# Altium schematic sheet EDU_High-Speed-Design_Connectors.SchDoc: Ethernet
size 431 x 279 mm; Date: not used; ApprovedBy: not used; CheckedBy: not used; Author: not used; DrawnBy: not used; Organization: not used; Address4: not used; SheetNumber: 6; SheetTotal: 26; Time: not used; ImagePath: not used; Application_BuildNumber: not used
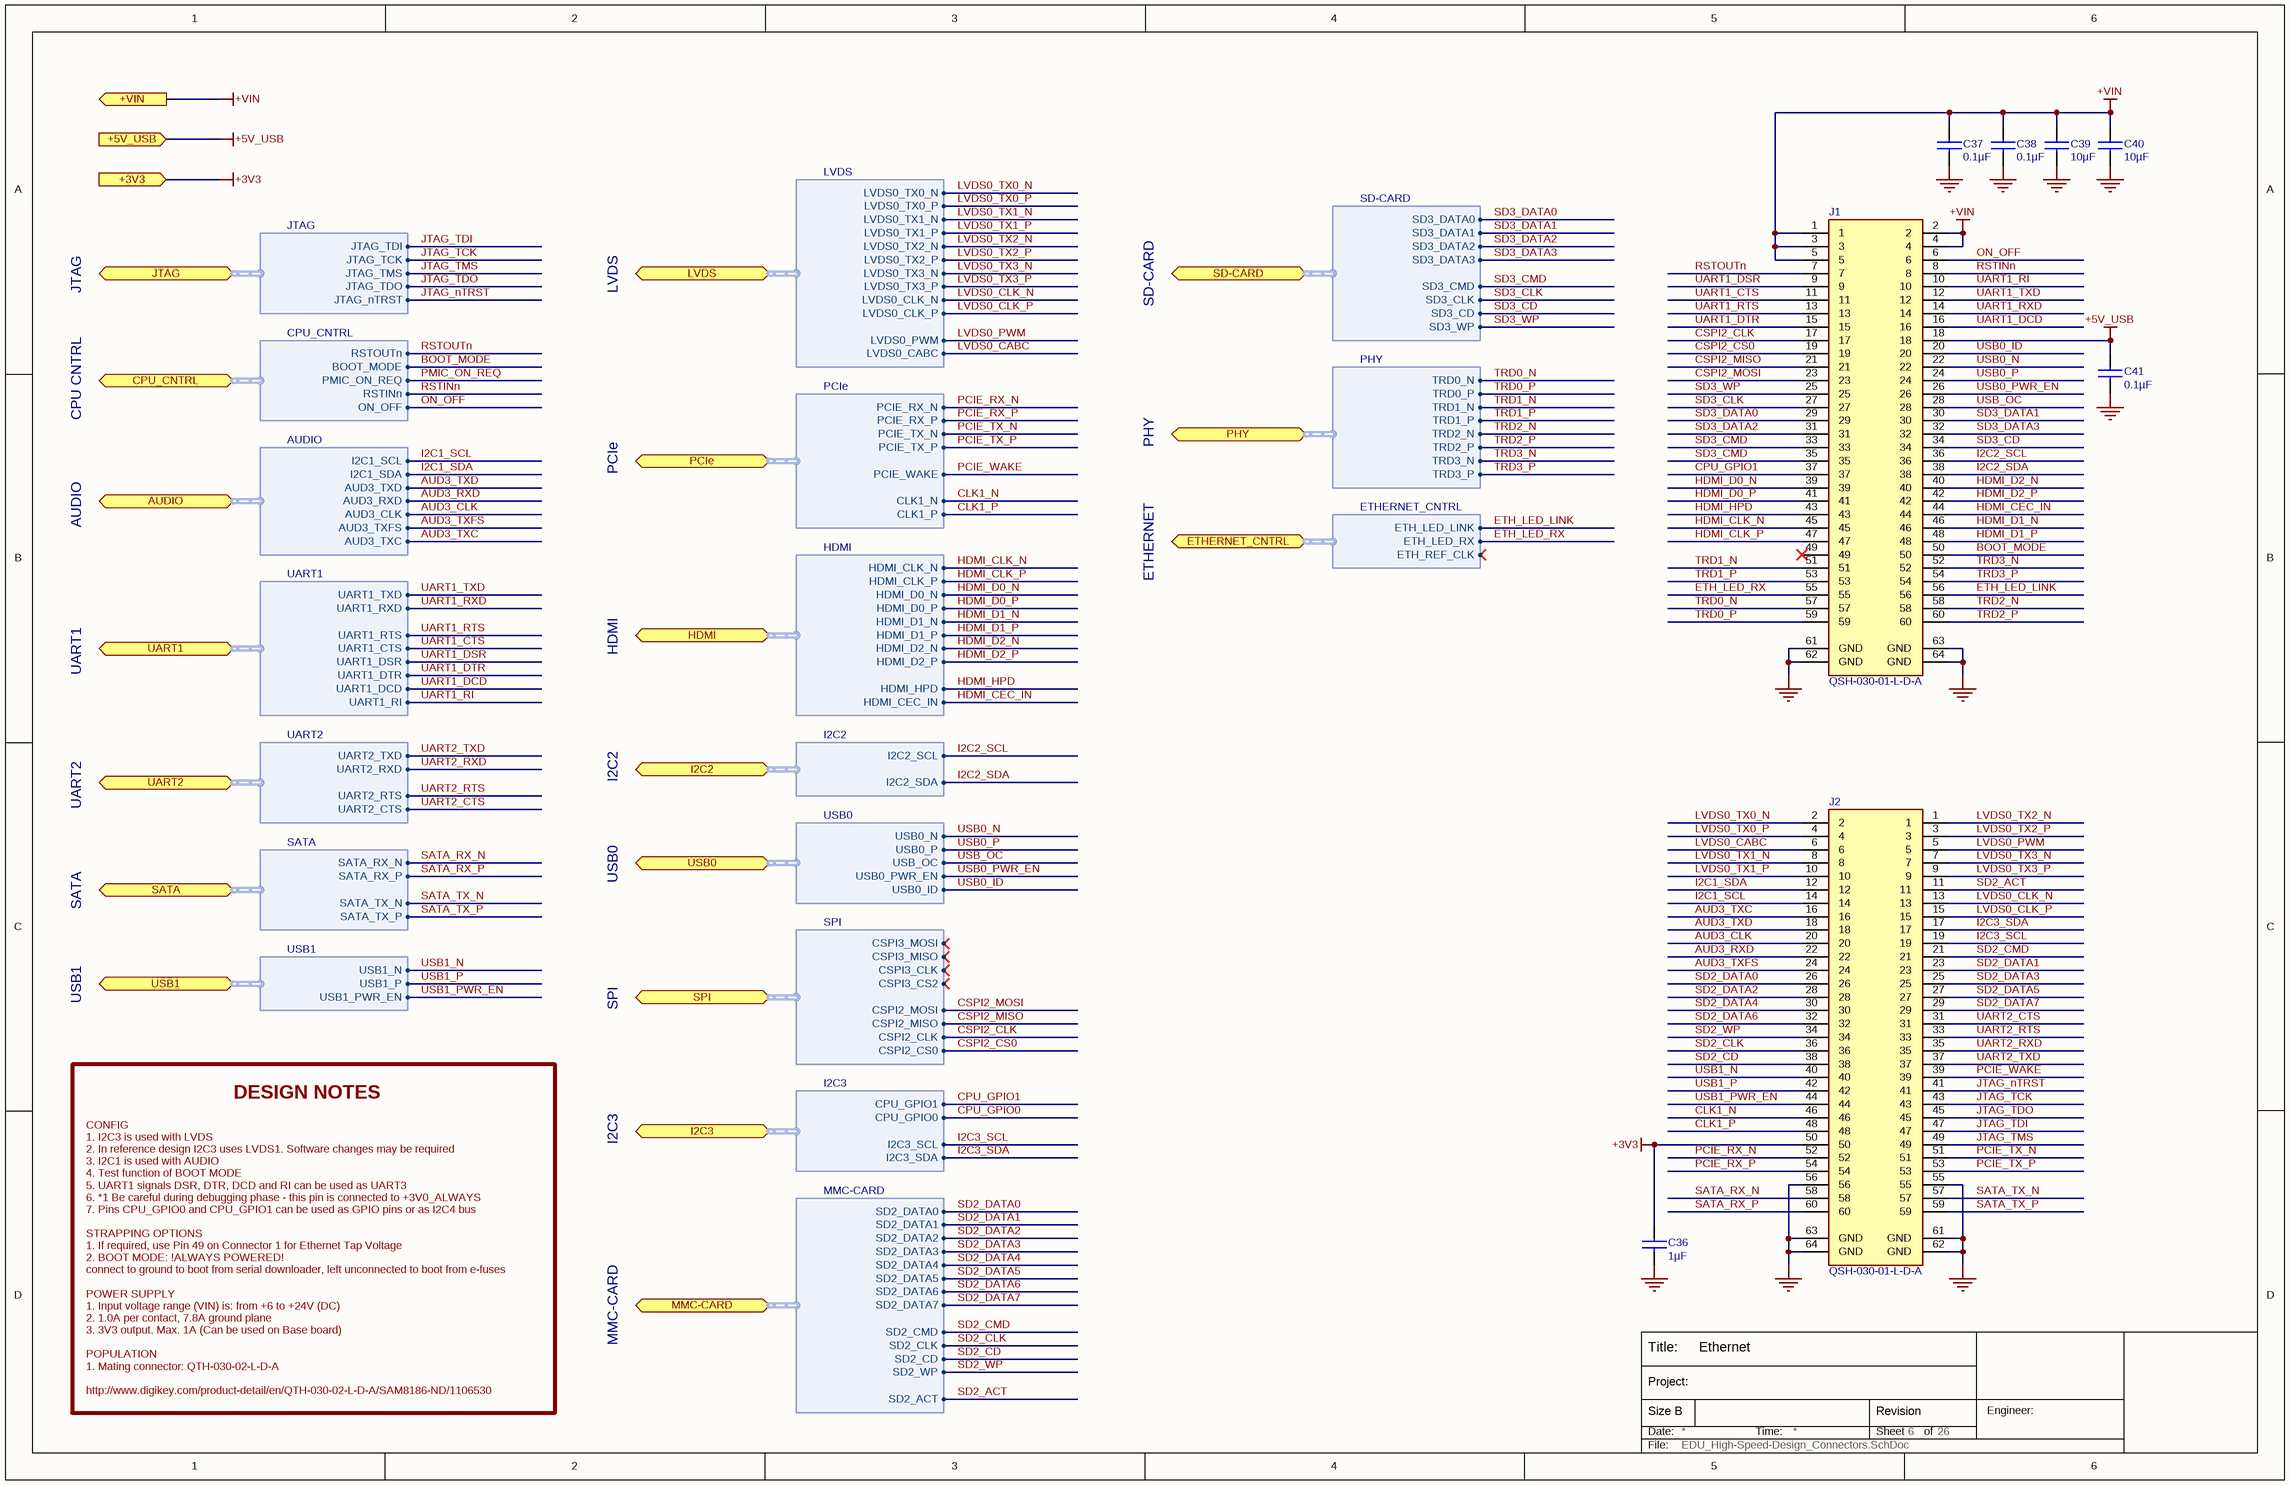
[diagram p0: EDU_High-Speed-Design_Connectors.SchDoc]

## Parts
C36  1µF  [C0402]
C37  0.1µF  [C0402]
C38  0.1µF  [C0402]
C39  10µF  [C1206]
C40  10µF  [C1206]
C41  0.1µF  [C0402]
J1  QSH-030-01-L-D-A  [QSH-030-01-L-D-A]
J2  QSH-030-01-L-D-A  [QSH-030-01-L-D-A]

## Ports
+3V3 (in), +5V_USB (in), +VIN (out), AUDIO (bidir, harness AUDIO), CPU_CNTRL (bidir, harness CPU_CNTRL), ETHERNET_CNTRL (bidir, harness ETHERNET_CNTRL), HDMI (bidir, harness HDMI), I2C2 (bidir, harness I2C2), I2C3 (bidir, harness I2C3), JTAG (bidir, harness JTAG), LVDS (bidir, harness LVDS), MMC-CARD (bidir, harness MMC-CARD), PCIe (bidir, harness PCIe), PHY (bidir, harness PHY), SATA (bidir, harness SATA), SD-CARD (bidir, harness SD-CARD), SPI (bidir, harness SPI), UART1 (bidir, harness UART1), UART2 (bidir, harness UART2), USB0 (bidir, harness USB0), USB1 (bidir, harness USB1)

## Harnesses
JTAG: JTAG_TDI, JTAG_TCK, JTAG_TMS, JTAG_nTRST, JTAG_TDO
CPU_CNTRL: RSTOUTn, PMIC_ON_REQ, ON_OFF, BOOT_MODE, RSTINn
AUDIO: I2C1_SCL, AUD3_TXD, AUD3_RXD, I2C1_SDA, AUD3_CLK, AUD3_TXFS, AUD3_TXC
UART1: UART1_TXD, UART1_RTS, UART1_CTS, UART1_RXD, UART1_DSR, UART1_DTR, UART1_DCD, UART1_RI
UART2: UART2_TXD, UART2_RTS, UART2_CTS, UART2_RXD
SATA: SATA_RX_N, SATA_TX_N, SATA_RX_P, SATA_TX_P
LVDS: LVDS0_TX0_N, LVDS0_TX1_P, LVDS0_TX2_N, LVDS0_TX1_N, LVDS0_TX2_P, LVDS0_TX0_P, LVDS0_TX3_N, LVDS0_TX3_P, LVDS0_CLK_N, LVDS0_CLK_P, LVDS0_PWM, LVDS0_CABC
PCIe: PCIE_RX_N, PCIE_TX_P, PCIE_TX_N, PCIE_WAKE, PCIE_RX_P, CLK1_N, CLK1_P
HDMI: HDMI_CLK_N, HDMI_D0_P, HDMI_D1_N, HDMI_D0_N, HDMI_D1_P, HDMI_CLK_P, HDMI_D2_N, HDMI_D2_P, HDMI_HPD, HDMI_CEC_IN
I2C2: I2C2_SCL, I2C2_SDA
USB0: USB0_N, USB_OC, USB0_PWR_EN, USB0_P, USB0_ID
USB1: USB1_N, USB1_PWR_EN, USB1_P
SPI: CSPI3_MOSI, CSPI3_MISO, CSPI3_CLK, CSPI3_CS2, CSPI2_MOSI, CSPI2_MISO, CSPI2_CLK, CSPI2_CS0
I2C3: CPU_GPIO0, I2C3_SCL, CPU_GPIO1, I2C3_SDA
MMC-CARD: SD2_DATA0, SD2_CLK, SD2_CD, SD2_WP, SD2_CMD, SD2_DATA1, SD2_DATA2, SD2_DATA3, SD2_DATA4, SD2_DATA5, SD2_DATA6, SD2_DATA7, SD2_ACT
SD-CARD: SD3_DATA0, SD3_DATA3, SD3_DATA2, SD3_CLK, SD3_DATA1, SD3_CD, SD3_WP, SD3_CMD
PHY: TRD0_N, TRD0_P, TRD1_N, TRD2_N, TRD2_P, TRD3_N, TRD1_P, TRD3_P
ETHERNET_CNTRL: ETH_LED_LINK, ETH_REF_CLK, ETH_LED_RX

## Nets
+3V3: C36.1 J2.50 ; port +3V3
+5V_USB: C41.1 J1.18 ; port +5V_USB
+VIN: C37.1 C38.1 C39.1 C40.1 J1.1 J1.2 J1.3 J1.4 J1.5 ; port +VIN
GND: C36.2 C37.2 C38.2 C39.2 C40.2 C41.2 J1.61(GND) J1.62(GND) J1.63(GND) J1.64(GND) J2.55 J2.56 J2.61(GND) J2.62(GND) J2.63(GND) J2.64(GND)
AUD3_CLK: J2.20 ; port AUDIO.AUD3_CLK
AUD3_RXD: J2.22 ; port AUDIO.AUD3_RXD
AUD3_TXC: J2.16 ; port AUDIO.AUD3_TXC
AUD3_TXD: J2.18 ; port AUDIO.AUD3_TXD
AUD3_TXFS: J2.24 ; port AUDIO.AUD3_TXFS
BOOT_MODE: J1.50 ; port CPU_CNTRL.BOOT_MODE
CLK1_N: J2.46 ; port PCIe.CLK1_N
CLK1_P: J2.48 ; port PCIe.CLK1_P
CPU_GPIO0: port I2C3.CPU_GPIO0
CPU_GPIO1: J1.37 ; port I2C3.CPU_GPIO1
CSPI2_CLK: J1.17 ; port SPI.CSPI2_CLK
CSPI2_CS0: J1.19 ; port SPI.CSPI2_CS0
CSPI2_MISO: J1.21 ; port SPI.CSPI2_MISO
CSPI2_MOSI: J1.23 ; port SPI.CSPI2_MOSI
ETH_LED_LINK: J1.56 ; port ETHERNET_CNTRL.ETH_LED_LINK
ETH_LED_RX: J1.55 ; port ETHERNET_CNTRL.ETH_LED_RX
HDMI_CEC_IN: J1.44 ; port HDMI.HDMI_CEC_IN
HDMI_CLK_N: J1.45 ; port HDMI.HDMI_CLK_N
HDMI_CLK_P: J1.47 ; port HDMI.HDMI_CLK_P
HDMI_D0_N: J1.39 ; port HDMI.HDMI_D0_N
HDMI_D0_P: J1.41 ; port HDMI.HDMI_D0_P
HDMI_D1_N: J1.46 ; port HDMI.HDMI_D1_N
HDMI_D1_P: J1.48 ; port HDMI.HDMI_D1_P
HDMI_D2_N: J1.40 ; port HDMI.HDMI_D2_N
HDMI_D2_P: J1.42 ; port HDMI.HDMI_D2_P
HDMI_HPD: J1.43 ; port HDMI.HDMI_HPD
I2C1_SCL: J2.14 ; port AUDIO.I2C1_SCL
I2C1_SDA: J2.12 ; port AUDIO.I2C1_SDA
I2C2_SCL: J1.36 ; port I2C2.I2C2_SCL
I2C2_SDA: J1.38 ; port I2C2.I2C2_SDA
I2C3_SCL: J2.19 ; port I2C3.I2C3_SCL
I2C3_SDA: J2.17 ; port I2C3.I2C3_SDA
JTAG_nTRST: J2.41 ; port JTAG.JTAG_nTRST
JTAG_TCK: J2.43 ; port JTAG.JTAG_TCK
JTAG_TDI: J2.47 ; port JTAG.JTAG_TDI
JTAG_TDO: J2.45 ; port JTAG.JTAG_TDO
JTAG_TMS: J2.49 ; port JTAG.JTAG_TMS
LVDS0_CABC: J2.6 ; port LVDS.LVDS0_CABC
LVDS0_CLK_N: J2.13 ; port LVDS.LVDS0_CLK_N
LVDS0_CLK_P: J2.15 ; port LVDS.LVDS0_CLK_P
LVDS0_PWM: J2.5 ; port LVDS.LVDS0_PWM
LVDS0_TX0_N: J2.2 ; port LVDS.LVDS0_TX0_N
LVDS0_TX0_P: J2.4 ; port LVDS.LVDS0_TX0_P
LVDS0_TX1_N: J2.8 ; port LVDS.LVDS0_TX1_N
LVDS0_TX1_P: J2.10 ; port LVDS.LVDS0_TX1_P
LVDS0_TX2_N: J2.1 ; port LVDS.LVDS0_TX2_N
LVDS0_TX2_P: J2.3 ; port LVDS.LVDS0_TX2_P
LVDS0_TX3_N: J2.7 ; port LVDS.LVDS0_TX3_N
LVDS0_TX3_P: J2.9 ; port LVDS.LVDS0_TX3_P
ON_OFF: J1.6 ; port CPU_CNTRL.ON_OFF
PCIE_RX_N: J2.52 ; port PCIe.PCIE_RX_N
PCIE_RX_P: J2.54 ; port PCIe.PCIE_RX_P
PCIE_TX_N: J2.51 ; port PCIe.PCIE_TX_N
PCIE_TX_P: J2.53 ; port PCIe.PCIE_TX_P
PCIE_WAKE: J2.39 ; port PCIe.PCIE_WAKE
PMIC_ON_REQ: port CPU_CNTRL.PMIC_ON_REQ
RSTINn: J1.8 ; port CPU_CNTRL.RSTINn
RSTOUTn: J1.7 ; port CPU_CNTRL.RSTOUTn
SATA_RX_N: J2.58 ; port SATA.SATA_RX_N
SATA_RX_P: J2.60 ; port SATA.SATA_RX_P
SATA_TX_N: J2.57 ; port SATA.SATA_TX_N
SATA_TX_P: J2.59 ; port SATA.SATA_TX_P
SD2_ACT: J2.11 ; port MMC-CARD.SD2_ACT
SD2_CD: J2.38 ; port MMC-CARD.SD2_CD
SD2_CLK: J2.36 ; port MMC-CARD.SD2_CLK
SD2_CMD: J2.21 ; port MMC-CARD.SD2_CMD
SD2_DATA0: J2.26 ; port MMC-CARD.SD2_DATA0
SD2_DATA1: J2.23 ; port MMC-CARD.SD2_DATA1
SD2_DATA2: J2.28 ; port MMC-CARD.SD2_DATA2
SD2_DATA3: J2.25 ; port MMC-CARD.SD2_DATA3
SD2_DATA4: J2.30 ; port MMC-CARD.SD2_DATA4
SD2_DATA5: J2.27 ; port MMC-CARD.SD2_DATA5
SD2_DATA6: J2.32 ; port MMC-CARD.SD2_DATA6
SD2_DATA7: J2.29 ; port MMC-CARD.SD2_DATA7
SD2_WP: J2.34 ; port MMC-CARD.SD2_WP
SD3_CD: J1.34 ; port SD-CARD.SD3_CD
SD3_CLK: J1.27 ; port SD-CARD.SD3_CLK
SD3_CMD: J1.33 J1.35 ; port SD-CARD.SD3_CMD
SD3_DATA0: J1.29 ; port SD-CARD.SD3_DATA0
SD3_DATA1: J1.30 ; port SD-CARD.SD3_DATA1
SD3_DATA2: J1.31 ; port SD-CARD.SD3_DATA2
SD3_DATA3: J1.32 ; port SD-CARD.SD3_DATA3
SD3_WP: J1.25 ; port SD-CARD.SD3_WP
TRD0_N: J1.57 ; port PHY.TRD0_N
TRD0_P: J1.59 ; port PHY.TRD0_P
TRD1_N: J1.51 ; port PHY.TRD1_N
TRD1_P: J1.53 ; port PHY.TRD1_P
TRD2_N: J1.58 ; port PHY.TRD2_N
TRD2_P: J1.60 ; port PHY.TRD2_P
TRD3_N: J1.52 ; port PHY.TRD3_N
TRD3_P: J1.54 ; port PHY.TRD3_P
UART1_CTS: J1.11 ; port UART1.UART1_CTS
UART1_DCD: J1.16 ; port UART1.UART1_DCD
UART1_DSR: J1.9 ; port UART1.UART1_DSR
UART1_DTR: J1.15 ; port UART1.UART1_DTR
UART1_RI: J1.10 ; port UART1.UART1_RI
UART1_RTS: J1.13 ; port UART1.UART1_RTS
UART1_RXD: J1.14 ; port UART1.UART1_RXD
UART1_TXD: J1.12 ; port UART1.UART1_TXD
UART2_CTS: J2.31 ; port UART2.UART2_CTS
UART2_RTS: J2.33 ; port UART2.UART2_RTS
UART2_RXD: J2.35 ; port UART2.UART2_RXD
UART2_TXD: J2.37 ; port UART2.UART2_TXD
USB0_ID: J1.20 ; port USB0.USB0_ID
USB0_N: J1.22 ; port USB0.USB0_N
USB0_P: J1.24 ; port USB0.USB0_P
USB0_PWR_EN: J1.26 ; port USB0.USB0_PWR_EN
USB1_N: J2.40 ; port USB1.USB1_N
USB1_P: J2.42 ; port USB1.USB1_P
USB1_PWR_EN: J2.44 ; port USB1.USB1_PWR_EN
USB_OC: J1.28 ; port USB0.USB_OC

Not connected (* = marked no-connect by the designer): J1 49* 65(HOLE1) 66(HOLE2); J2 65(HOLE1) 66(HOLE2)

## Notes on the sheet
- JTAG
- LVDS
- SD-CARD
- CPU CNTRL
- PCIe
- PHY
- AUDIO
- ETHERNET
- UART1
- HDMI
- UART2
- I2C2
- USB0
- SATA
- USB1
- SPI
- DESIGN NOTES
- I2C3
- MMC-CARD
- CONFIG
  1. I2C3 is used with LVDS
  2. In reference design I2C3 uses LVDS1. Software changes may be required
  3. I2C1 is used with AUDIO
  4. Test function of BOOT MODE
  5. UART1 signals DSR, DTR, DCD and RI can be used as UART3
  6. *1 Be careful during debugging phase - this pin is connected to +3V0_ALWAYS
  7. Pins CPU_GPIO0 and CPU_GPIO1 can be used as GPIO pins or as I2C4 bus
  STRAPPING OPTIONS
  1. If required, use Pin 49 on Connector 1 for Ethernet Tap Voltage
  2. BOOT MODE: !ALWAYS POWERED!
  connect to ground to boot from serial downloader, left unconnected to boot from e-fuses
  POWER SUPPLY
  1. Input voltage range (VIN) is: from +6 to +24V (DC)
  2. 1.0A per contact, 7.8A ground plane
  3. 3V3 output. Max. 1A (Can be used on Base board)
  POPULATION
  1. Mating connector: QTH-030-02-L-D-A
  http://www.digikey.com/product-detail/en/QTH-030-02-L-D-A/SAM8186-ND/1106530
- Title:
- Date:
- Size B
- Project:
- Time:
- Sheet
- Revision
- of
- Engineer:
- File:

## Library data of the parts
C36 = C1005X5R1C105K: CAP CER 1.0UF 16V X5R 0402; Manufacturer 1: TDK Corporation; Capacitance: 1µF; Manufacturer Part Number 1: C1005X5R1C105K; Voltage: 16V; Supplier 1: Digi-Key; Supplier Part Number 1: 445-4978-1-ND; ComponentLink1URL: http://www.tdk.co.jp/tefe02/e412_c.pdf; ComponentLink1Description: http://www.tdk.co.jp/tefe02/e412_c.pdf
C37 C38 C41 = C1005X5R1H104K: CAP CER .10UF 50V X5R 10% 0402; Manufacturer 1: TDK Corporation; Capacitance: 0.1µF; Manufacturer Part Number 1: C1005X5R1H104K; Voltage: 50V; Supplier 1: Digi-Key; Supplier Part Number 1: 445-5942-1-ND; ComponentLink1URL: http://www.tdk.co.jp/tefe02/e412_c.pdf; ComponentLink1Description: http://www.tdk.co.jp/tefe02/e412_c.pdf
C39 C40 = GRM31CR6YA106KA12L: CAP CER 10UF 35V X5R 1206; Manufacturer 1: Murata Electronics North America; Capacitance: 10µF; Manufacturer Part Number 1: GRM31CR6YA106KA12L; Supplier 1: Digi-Key; Supplier Part Number 1: 490-5524-1-ND; ComponentLink1URL: http://www.murata.com/products/catalog/pdf/c02e.pdf; ComponentLink1Description: http://www.murata.com/products/catalog/pdf/c02e.pdf; Voltage: 35V
J1 J2 = QSH-030-01-L-D-A: CONN RCPT HI-SPD .5MM 60POS DL; Manufacturer 1: Samtec Inc; Manufacturer Part Number 1: QSH-030-01-L-D-A; Supplier 1: Digi-Key; Supplier Part Number 1: SAM8180-ND